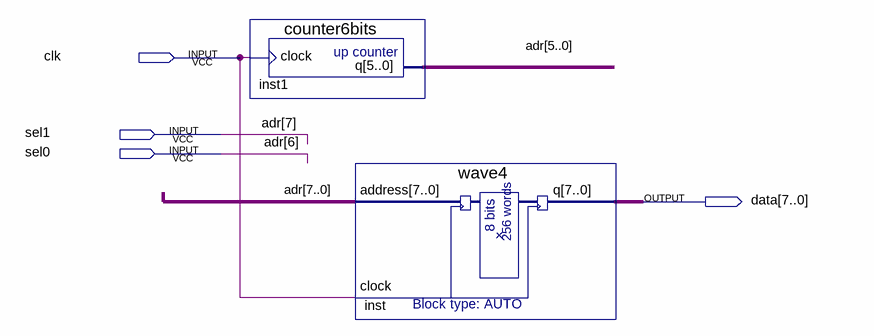
[diagram p0: schematic sheet]
// Quartus schematic DAC.bdf as structural Verilog: 2 symbols, 4 pins
module DAC (
  input  clk,
  input  sel1,
  input  sel0,
  output [7:0] data
);

  wire [5:0] adr;

  counter6bits inst1 (.clock(clk), .q(adr));
  wave4 inst (.address({sel1, sel0, adr}), .clock(clk), .q(data));

  // Other names for the same wires on the sheet: adr[7:6] = {sel1, sel0}
endmodule
